# Altium schematic sheet USB-HOST.SchDoc
size B
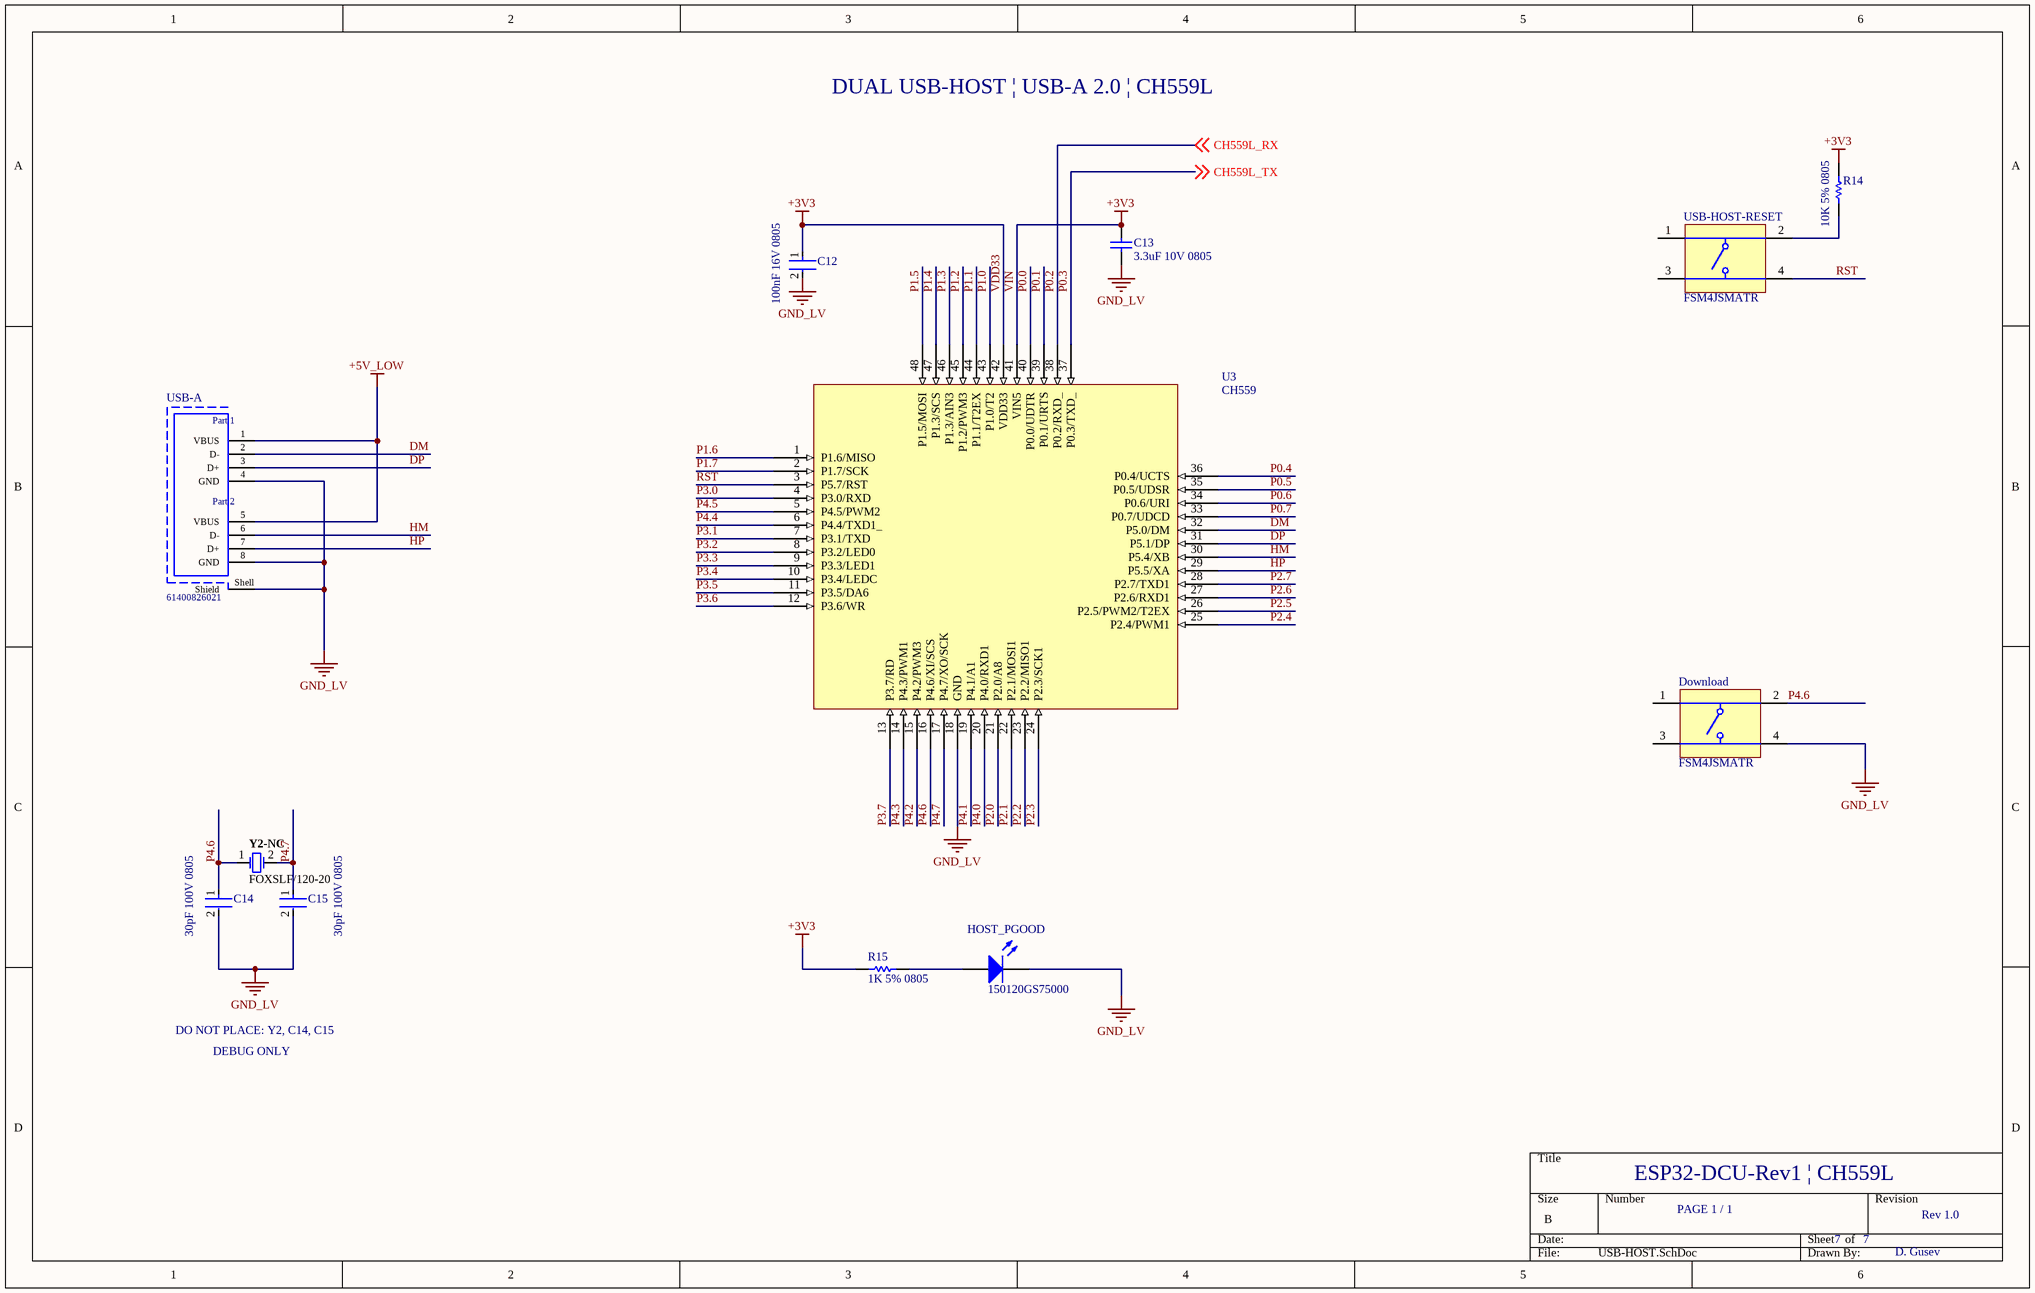
[diagram p0: USB-HOST.SchDoc]

## Parts
C12  100nF 16V 0805  [FP-C0805C-DN-MFG]
C13  3.3uF 10V 0805  [CAPC2013X140X50LL20T25]
C14  30pF 100V 0805  [FP-C0805C-DN-MFG]
C15  30pF 100V 0805  [FP-C0805C-DN-MFG]
Download  FSM4JSMATR  [TECO-FSM4JSMATR_V]
HOST_PGOOD  150120GS75000  [1206_A]
R14  10K 5% 0805  [RESC2013X60X40ML20T25]
R15  1K 5% 0805  [RESC2013X60X40ML20T25]
U3  CH559  [CH559L]
USB-A  61400826021  [61400826021]
USB-HOST-RESET  FSM4JSMATR  [TECO-FSM4JSMATR_V]
Y2-NC  FOXSLF/120-20  [FOX-FOXSLF-2_V]

## Nets
+5V_LOW: USB-A.1(VBUS) USB-A.5(VBUS)
GND_LV: C12.2 C13.1 C14.2 C15.2 Download.4 HOST_PGOOD.1(K) U3.18(GND) USB-A.4(GND) USB-A.8(GND) USB-A.Shell(Shield)
VDD33: C12.1 C13.2 R14.2 R15.2 U3.41(VIN5) U3.42(VDD33)  [also labelled +3V3, VIN]
DM: U3.32(P5.0/DM) USB-A.2(D-)
DP: U3.31(P5.1/DP) USB-A.3(D+)
HM: U3.30(P5.4/XB) USB-A.6(D-)
HP: U3.29(P5.5/XA) USB-A.7(D+)
P0.0: U3.40(P0.0/UDTR)
P0.1: U3.39(P0.1/URTS)
P0.2: U3.38(P0.2/RXD_) ; off-sheet CH559L_RX  [also labelled CH559L_RX]
P0.3: U3.37(P0.3/TXD_) ; off-sheet CH559L_TX  [also labelled CH559L_TX]
P0.4: U3.36(P0.4/UCTS)
P0.5: U3.35(P0.5/UDSR)
P0.6: U3.34(P0.6/URI)
P0.7: U3.33(P0.7/UDCD)
P1.0: U3.43(P1.0/T2)
P1.1: U3.44(P1.1/T2EX)
P1.2: U3.45(P1.2/PWM3)
P1.3: U3.46(P1.3/AIN3)
P1.4: U3.47(P1.3/SCS)
P1.5: U3.48(P1.5/MOSI)
P1.6: U3.1(P1.6/MISO)
P1.7: U3.2(P1.7/SCK)
P2.0: U3.21(P2.0/A8)
P2.1: U3.22(P2.1/MOSI1)
P2.2: U3.23(P2.2/MISO1)
P2.3: U3.24(P2.3/SCK1)
P2.4: U3.25(P2.4/PWM1)
P2.5: U3.26(P2.5/PWM2/T2EX)
P2.6: U3.27(P2.6/RXD1)
P2.7: U3.28(P2.7/TXD1)
P3.0: U3.4(P3.0/RXD)
P3.1: U3.7(P3.1/TXD)
P3.2: U3.8(P3.2/LED0)
P3.3: U3.9(P3.3/LED1)
P3.4: U3.10(P3.4/LEDC)
P3.5: U3.11(P3.5/DA6)
P3.6: U3.12(P3.6/WR)
P3.7: U3.13(P3.7/RD)
P4.0: U3.20(P4.0/RXD1)
P4.1: U3.19(P4.1/A1)
P4.2: U3.15(P4.2/PWM3)
P4.3: U3.14(P4.3/PWM1)
P4.4: U3.6(P4.4/TXD1_)
P4.5: U3.5(P4.5/PWM2)
P4.6: C14.1 Download.2 U3.16(P4.6/XI/SCS) Y2-NC.1
P4.7: C15.1 U3.17(P4.7/XO/SCK) Y2-NC.2
RST: U3.3(P5.7/RST) USB-HOST-RESET.4
NetHOST_PGOOD_2: HOST_PGOOD.2(A) R15.1
NetR14_1: R14.1 USB-HOST-RESET.2

Not connected (* = marked no-connect by the designer): Download 1 3; USB-HOST-RESET 1 3

## Notes on the sheet
- DUAL USB-HOST | USB-A 2.0 | CH559L
- DO NOT PLACE: Y2, C14, C15
- DEBUG ONLY
- ESP32-DCU-Rev1 | CH559L
- PAGE 1 / 1
- 7
- Rev 1.0
- D. Gusev
- (in symbol CMP-1502-03229-1) Part 1; Part 2

## Library data of the parts
C12 = CMP-2007-00279-2: CAP CER 0.1UF 50V X7R 0805; Manufacturer Part Number: C0805C104K5RACTU; Manufacturer: KEMET; Value: 0.10 μF; Tolerance: 0.1; Temperature Coefficient: 30ppm/°C; Material: Ceramic; Device Class L2: Capacitors; Temperature Range Low: -55°C; Voltage Rating: 50 V; Digikey Description: CAP CER 0.1UF 50V X7R 0805; Category: Cap; ComponentLink2Description: Datasheet; Octopart: https://octopart.com/c0805c104k5ractu-kemet-143926; RoHS: TRUE; ComponentLink2URL: https://content.kemet.com/datasheets/KEM_C1003_C0G_SMD.pdf; Temperature Characteristic: X7R; Temperature: -55°C to +125°C; Height: 0.88mm; Temperature Range High: +125°C; Device Class L1: Passive Components; Automotive: No; Lead Free: Yes; Ipc Land Pattern Name: CAPC200125X78; Device Class L3: Ceramic Capacitors; Mouser Description: Cap Ceramic 0.1uF 50V X7R 10% SMD 2.0 x 1.2 mm 125 C Paper T/R; Capacitance: 0.10 μF; Package: C0805C-DN
C13 = CMP-2007-04685-1: Part Number: 0805ZD335KAT2A; Manufacturer: AVX Interconnect / Elco
C14 C15 = CMP-2007-00448-2: CAP CER 22PF 100V 5% NP0 0805; Manufacturer Part Number: C0805C220J1GACTU; Manufacturer: KEMET; Material: Ceramic; Temperature Coefficient: 30ppm/°C; Tolerance: 0.05; Temperature Characteristic: C0G; Value: 22 pF; RoHS: TRUE; ComponentLink2URL: https://content.kemet.com/datasheets/KEM_C1003_C0G_SMD.pdf; Capacitance: 22 pF; Mouser Description: Multilayer Ceramic Capacitor, C Series, 22 Pf, - 5%, C0g / Np0, 100 V, 0805 [2012 Metric] Rohs Compliant: Yes; Digikey Description: CAP CER 22PF 100V 5% NP0 0805; Octopart: https://octopart.com/c0805c220j1gactu-kemet-3791395; Device Class L3: Ceramic Capacitors; Device Class L2: Capacitors; Voltage Rating: 100 V; Temperature Range Low: -55°C; Ipc Land Pattern Name: CAPC200125X78; Lead Free: Yes; ComponentLink2Description: Datasheet; Category: Cap; Temperature: -55°C to +125°C; Package: C0805C-DN; Device Class L1: Passive Components; Temperature Range High: +125°C; Height: 0.88mm; Automotive: No
Download USB-HOST-RESET = CMP-2000-07486-1: Micro Miniature Push Button Switch FSM JSM, 50 mA, -35 to 85 degC, 4-Pin SMD, RoHS, Tape and Reel; Manufacturer: TE Connectivity; Mechanical Life: 100000Cycles; Current Rating: 50mA; Actuator Material: Polyamide; Max Voltage Rating (DC): 12V; Capacitance: 0f; Illumination Type: Illuminated; Voltage Rating (DC): 24V; Case\/Package: SMD/SMT; Operating Force: 160gf; Contact Resistance: 100mOhm; Actuator Length: 0.055inch; Switch Travel: 0.25mm; Throw Configuration: SPST; Termination: GullWing; Contact Plating: Silver; Orientation: Straight; Mounting Technology: SurfaceMount; REACH SVHC: Unknown; Electrical Life: 100000Cycles; Package Reference: FSM4JSMATR; Max Operating Temperature: 85degC; Manufacturer URL: http://www.te.com/; Package Description: 4-Pin Surface Mount Device, Body 6 x 6 mm, Pitch 4.5 mm; Datasheet Version: Rev. V, 02/2015; Packaging: TapeandReel; Min Operating Temperature: -35degC; Mount: SurfaceMount; Contact Current Rating: 50mA; Contact Material: CopperAlloy; Package Quantity: 1200; Datasheet URL: http://www.te.com/commerce/DocumentDelivery/DDEController?Action=showdoc&DocId=Customer+Drawing%7F2-1437565-7%7FV%7Fpdf%7FEnglish%7FENG_CD_2-1437565-7_V.pdf%7F4-1437565-2; RoHSCompliant: true
HOST_PGOOD = CMP-1426-00014-1: SMD mono-color Chip LED, WL-SMCW, Green; Manufacturer: Wuerth Elektronik; PackageReference: 1206_A; PartNumber: 150120GS75000; ComponentLink1Description: Manufacturer URL; ComponentLink2URL: http://katalog.we-online.com/led/datasheet/150120GS75000.pdf; ComponentLink2Description: Datasheet; Color: Green; ComponentLink1URL: http://www.we-online.com
R14 R15 = CMP-2001-00590-1: Part Number: ERA6AEB123V; Manufacturer: Panasonic
U3 = CH559: DUAL USB-HOST 2.0
USB-A = CMP-1502-03229-1: USB 2.0 Type A Receptacle WR-COM, Stacked Horizontal, THT; Manufacturer: Wurth Elektronik; Contact Resistance: 20mOhm; Rated Current: 1.5A; Working Voltage: 30VAC; Connector Type: USB2.0TypeA; Packaging: Tray; Package Reference: 61400826021; Mounting Technology: THT; Datasheet URL: https://katalog.we-online.de/em/datasheet/61400826021.pdf; Operating Temperature: -40to105degC; Gender: Receptacle; Orientation: StackedHorizontal; Part Number: 61400826021; Publisher: WurthElektronik; Manufacturer URL: http://www.we-online.de
Y2-NC = CMP-1749-00004-1: Resistance Weld Thru-Hole Crystal, 12 MHz, +/-30 ppm, -20 to 70 degC, 2-Pin THD, RoHS, Bulk; Elements: 1; Rds On Max: 115 mohm; Typical Rise Time: 90 ns; Max Power Dissipation: 2.5 W; Case\Package: TO-251-3; Input Capacitance: 350 pF; REACH SVHC: No SVHC; Length: 6.6 mm; ComponentLink1URL: http://www.foxonline.com/; PackageDescription: 2-Pin Through Hole Device, Body 11.35 x 4.65 mm, Pitch 4.88 mm; Radiation Hardening: No; Package Quantity: 70; Packaging: Rail/Tube; ComponentLink1Description: Manufacturer URL; Min Operating Temperature: -55 degC; Max Operating Temperature: 150 degC; RoHSCompliant: true; PackageReference: FOXSLF-2; DatasheetVersion: Mar-15; Pins: 3; Height: 6.1 mm; Mount: Through Hole; ComponentLink2URL: http://www.foxonline.com/pdfs/hc49slf.pdf; ComponentLink2Description: Datasheet; Width: 2.3 mm